# Altium schematic sheet Cover.SchDoc
size A3; ApprovedBy: Arş.Gör.Dr Şaban ULUS; CheckedBy: Arş.Gör.Dr Şaban ULUS; Engineer: Nasıf Can PELTEK; DocumentNumber: 1; Revision: -; SheetNumber: 1; SheetTotal: 2; releaseDate: 06.03.2023; changeDate: -; Department: Faculty Of Enginnering; Size: A3; projeDescription: 1S BMS PROTOYPE; fileName: Cover.SchDoc
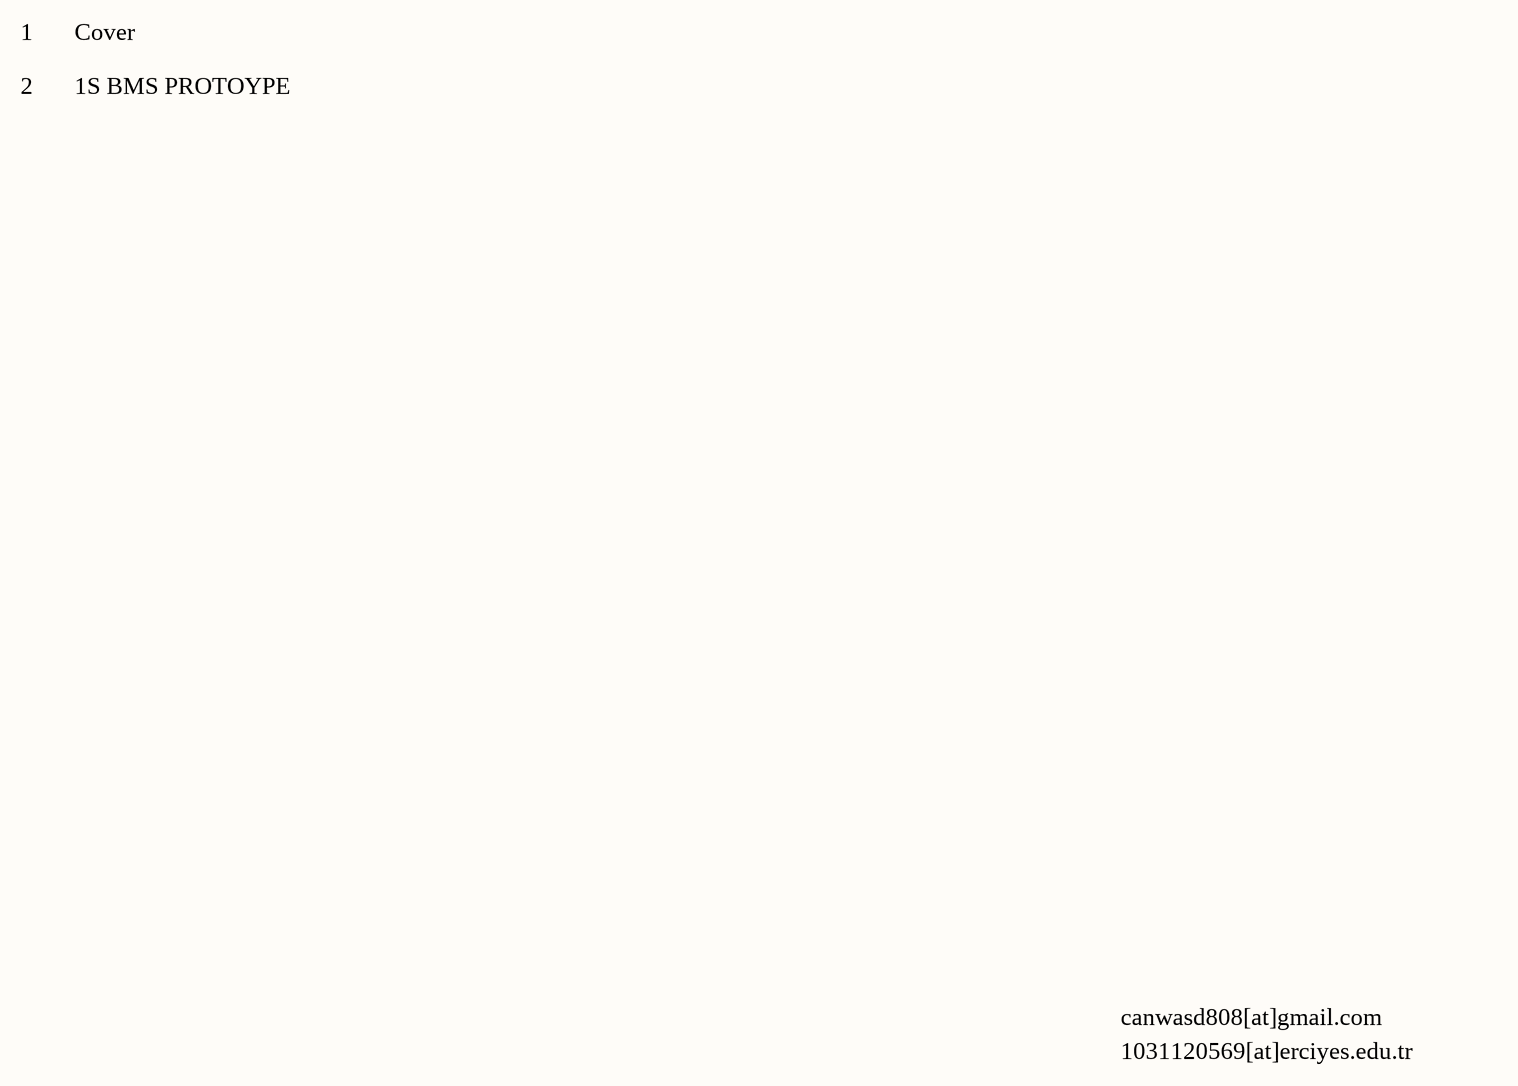
[diagram p0: Cover.SchDoc]

## Notes on the sheet
- 1
- Cover
- 2
- 1S BMS PROTOYPE
- canwasd808[at]gmail.com
- 1031120569[at]erciyes.edu.tr
- Page No
- CONTENTS
- Description
- Date
- REVISION
- PRODUCTION NOTES
- Board Function
- Gerber Files
- Attachments
- CONTACT
- FILE NAME
- PREPARED BY
- DESCRIPTION
- RELEASE DATE
- DEPARTMENT
- CHECKED BY
- APPROVED BY
- SIZE
- CHANGE DATE
- SHEET
- /